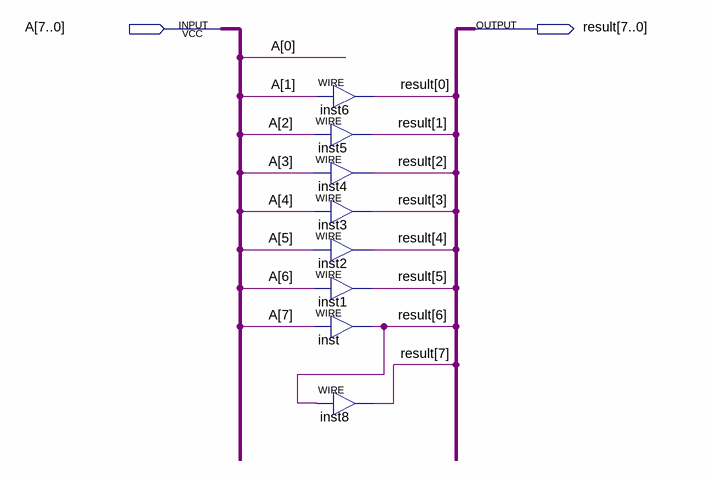
[diagram p0: schematic sheet]
// Quartus schematic ALU_SHRA1.bdf as structural Verilog: 8 symbols, 2 pins
module ALU_SHRA1 (
  input  [7:0] A,
  output [7:0] result
);

  assign result[0] = A[1];  // WIRE inst6
  assign result[1] = A[2];  // WIRE inst5
  assign result[2] = A[3];  // WIRE inst4
  assign result[3] = A[4];  // WIRE inst3
  assign result[4] = A[5];  // WIRE inst2
  assign result[5] = A[6];  // WIRE inst1
  assign result[6] = A[7];  // WIRE inst
  assign result[7] = result[6];  // WIRE inst8
endmodule
